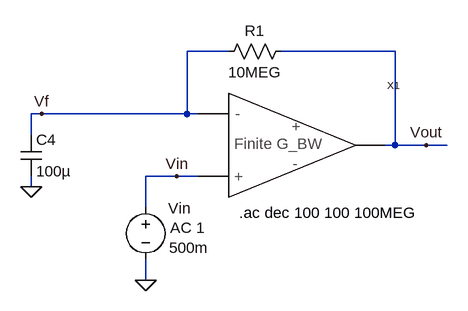
[diagram p0: schematic FiniteGBW_op_amp_AC.asc]
FiniteGBW_op_amp_AC.asc, the LTspice schematic file:
Version 4
SHEET 1 2760 680
WIRE 1376 -224 1376 -256
WIRE 1376 -144 1376 -160
WIRE 1392 -256 1376 -256
WIRE 1552 -112 1552 -160
WIRE 1552 0 1552 -32
WIRE 1600 -160 1552 -160
WIRE 1616 -256 1392 -256
WIRE 1616 -256 1616 -352
WIRE 1632 -256 1616 -256
WIRE 1632 -160 1600 -160
WIRE 1680 -352 1616 -352
WIRE 1936 -352 1760 -352
WIRE 1936 -208 1920 -208
WIRE 1936 -208 1936 -352
WIRE 1984 -208 1936 -208
WIRE 2016 -208 1984 -208
FLAG 1376 -144 0
FLAG 1392 -256 Vf
FLAG 1984 -208 Vout
FLAG 1552 0 0
FLAG 1600 -160 Vin
SYMBOL cap 1360 -224 R0
SYMATTR InstName C4
SYMATTR Value 100µ
SYMBOL res 1776 -368 R90
WINDOW 0 0 56 VBottom 0
WINDOW 3 32 56 VTop 0
SYMATTR InstName R1
SYMATTR Value 10MEG
SYMBOL Gain_BW_op_amp 1680 -208 R0
SYMATTR InstName X1
SYMBOL voltage 1552 -128 R0
WINDOW 0 35 17 Left 0
WINDOW 3 36 78 Left 0
WINDOW 123 38 47 Left 0
WINDOW 39 0 0 Left 0
SYMATTR InstName Vin
SYMATTR Value 500m
SYMATTR Value2 AC 1
TEXT 1696 -104 Left 0 !.ac dec 100 100 100MEG

The netlist it stands for:
* FiniteGBW_op_amp_AC.asc
C4 Vf 0 100µ
R1 Vout Vf 10MEG
XX1 Vf Vin Vout Gain_BW_op_amp  ; pins Vinm Vinp Out
Vin Vin 0 500m AC 1
.ac dec 100 100 100MEG
.backanno
.end